# Altium schematic sheet extra.SchDoc: DE:TMP:11:UC:EXPANDIDO
size 233 x 191 mm; Date: 21-07-2022; SheetNumber: 1; SheetTotal: 1; WebFGR: www.abebashop.com; VersionFGR: 20220721; PageSetup: Record=PageOptions|CenterHorizontal=True|CenterVertical=True|PrintScale=0.94|XCorrection=1.00|YCorrection=1.00|PrintKind=0|BorderSize=5000000|LeftOffset=0|BottomOffset=0|Orientation=2|PaperLength=1000|PaperWidth=1000|Scale=100|PaperSource=7|PrintQuality=-4|MediaType=1|DitherType=10|PaperKind=Letter|PrintScaleMode=1
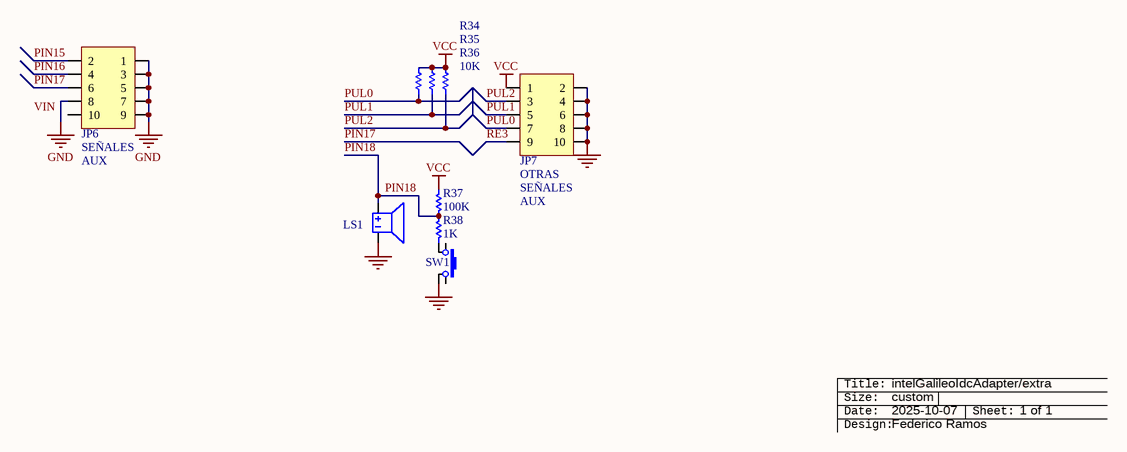
[diagram p0: extra.SchDoc]

## Parts
JP6  Price: SEÑALES  [idc5x2]  (hidden comment: IDC 5x2)
JP7  IDC 5x2  [idc5x2]  (value not drawn)
LS1  Buzzer  [buzzer12mm]  (value not drawn)
R34  Resistencia 1206; 10Kohm  [R1206]  (value not drawn)
R35  Resistencia 1206; 10Kohm  [R1206]  (value not drawn)
R36  Resistencia: 10K  [R1206]  (hidden comment: Resistencia 1206; 10Kohm)
R37  Resistencia: 100K  [R1206]  (hidden comment: Resistencia 1206; 10Kohm)
R38  Resistencia: 1K  [R1206]  (hidden comment: Resistencia 1206; 10Kohm)
ROT?  Rotulo_empty  (value not drawn)  (graphical)
SW1  SW_T_5MM  [SW_T_5MM]  (value not drawn)

## Nets
GND: JP6.1 JP6.3 JP6.5 JP6.7 JP6.8 JP6.9 JP7.2 JP7.4 JP7.6 JP7.8 JP7.10 LS1.2 SW1.2
VCC: JP7.1 R34.2 R35.2 R36.2 R37.2
PIN15: JP6.2
PIN16: JP6.4
PIN17: JP6.6
PIN18: LS1.1 R37.1 R38.2
PUL0: JP7.7 R34.1
PUL1: JP7.5 R35.1
PUL2: JP7.3 R36.1
RE3: JP7.9
NetR38_1: R38.1 SW1.1

Not connected (* = marked no-connect by the designer): JP6 10; SW1 3 4

## Notes on the sheet
- intelGalileoIdcAdapter/extra
- custom
- 2025-10-07
- (near ROT?) 1 of 1
- Federico Ramos
- Labels drawn without touching a wire or pin: VIN
- (in symbol IDC 5x2) AUX; OTRAS; SEÑALES
- (in symbol Rotulo_empty) Title:; Size:; Date:; Sheet:; Design:

## Library data of the parts
R34 R35 = Resistencia 1206; 10Kohm: Codigo Elemon: RS3886245; Dolares Elemon: 0.00718; Resistencia: 10K
R36-R38 = Resistencia 1206; 10Kohm: Codigo Elemon: RS3886245; Dolares Elemon: 0.00718
ROT? = Rotulo_empty: Rotulo [consolas]
JP6 JP7 = IDC 5x2
  JP7: Price: ?
LS1 = Buzzer: Price: ?
SW1 = SW_T_5MM: Price: ?